# Altium schematic sheet power.SchDoc
size A4; SheetNumber: 3; SheetTotal: 7
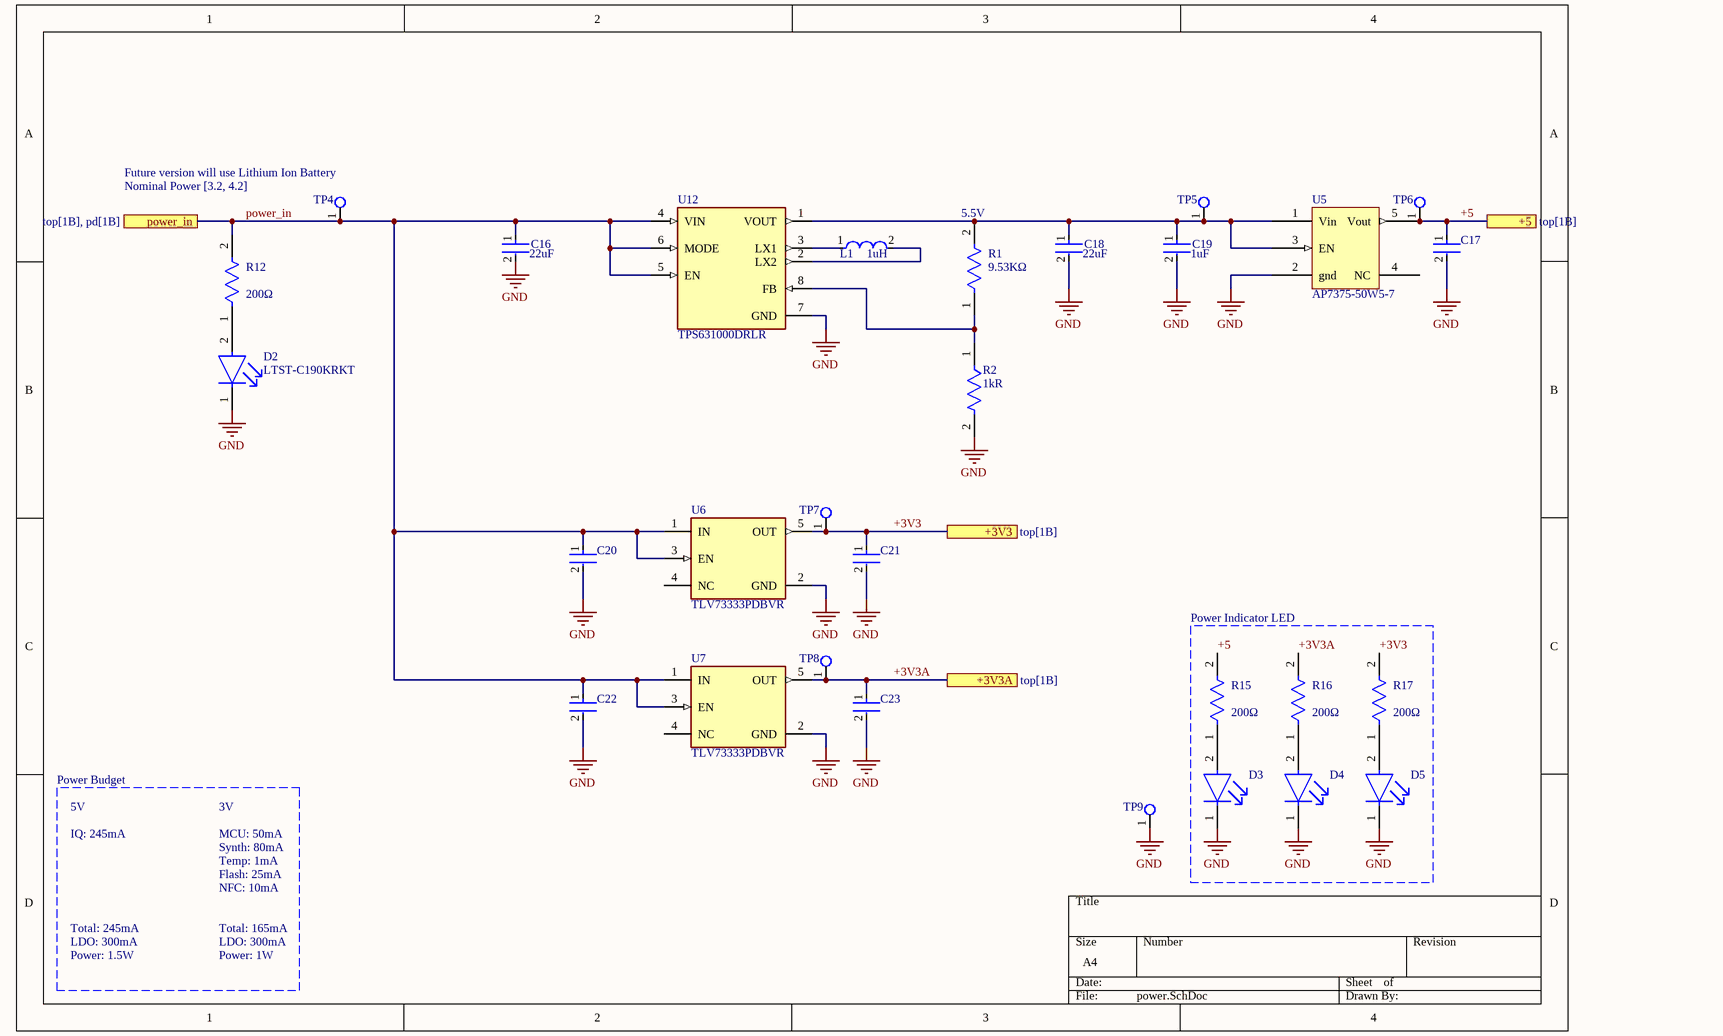
[diagram p0: power.SchDoc]

## Parts
C16  Capacitance: 22uF  [FP-GRM188-0_2-IPC_C]  (hidden comment: GRM188R61A226ME15D)
C17  GRM155R61A106ME11D  [FP-GRM155-0_2-IPC_A]  (value not drawn)
C18  Capacitance: 22uF  [FP-GRM188-0_2-IPC_C]  (hidden comment: GRM188R61A226ME15D)
C19  Capacitance: 1uF  [FP-CL10-IPC_C]  (hidden comment: CL10B105KP8NNNC)
C20  GRM155R61A106ME11D  [FP-GRM155-0_2-IPC_A]  (value not drawn)
C21  GRM155R61A106ME11D  [FP-GRM155-0_2-IPC_A]  (value not drawn)
C22  GRM155R61A106ME11D  [FP-GRM155-0_2-IPC_A]  (value not drawn)
C23  GRM155R61A106ME11D  [FP-GRM155-0_2-IPC_A]  (value not drawn)
D2  LTST-C190KRKT  [FP-LTST-C190KRKT-MFG]
D3  LTST-C190KRKT  [FP-LTST-C190KRKT-MFG]  (value not drawn)
D4  LTST-C190KRKT  [FP-LTST-C190KRKT-MFG]  (value not drawn)
D5  LTST-C190KRKT  [FP-LTST-C190KRKT-MFG]  (value not drawn)
L1  Inductance: 1uH  [FP-LQM21PH_G0-IPC_C]  (hidden comment: LQM21PN1R0NGRD)
R1  value 9.53KΩ  [FP-RT0603-MFG]  (hidden comment: RT0603BRD079K53L)
R2  Resistance: 1kR  [FP-RC0603-0_55-IPC_C]  (hidden comment: RC0603FR-071KL)
R12  value 200Ω  [FP-RT0402-MFG]  (hidden comment: RT0402BRD07200RL)
R15  value 200Ω  [FP-RT0402-MFG]  (hidden comment: RT0402BRD07200RL)
R16  value 200Ω  [FP-RT0402-MFG]  (hidden comment: RT0402BRD07200RL)
R17  value 200Ω  [FP-RT0402-MFG]  (hidden comment: RT0402BRD07200RL)
TP4  Test Point  [test_point]  (value not drawn)
TP5  Test Point  [test_point]  (value not drawn)
TP6  Test Point  [test_point]  (value not drawn)
TP7  Test Point  [test_point]  (value not drawn)
TP8  Test Point  [test_point]  (value not drawn)
TP9  Test Point  [test_point]  (value not drawn)
U5  AP7375-50W5-7  [DIODES SOT25]
U6  TLV73333PDBVR  [FP-DBV0005A-MFG]
U7  TLV73333PDBVR  [FP-DBV0005A-MFG]
U12  TPS631000DRLR  [SOT50P160X60-8N]

## Blocks framed on the sheet
Power Indicator LED: D3-D5 R15-R17

## Ports
+3V3 (see top[1B]), +3V3A (see top[1B]), +5 (see top[1B]), power_in (see top[1B], pd[1B])

## Nets
GND: C16.2 C17.2 C18.2 C19.2 C20.2 C21.2 C22.2 C23.2 D2.1(C) D3.1(C) D4.1(C) D5.1(C) R2.2 TP9.1 U5.2(gnd) U6.2(GND) U7.2(GND) U12.7(GND)
+3V3: C21.1 R17.2 TP7.1 U6.5(OUT) ; port +3V3
+3V3A: C23.1 R16.2 TP8.1 U7.5(OUT) ; port +3V3A
+5: C17.1 R15.2 TP6.1 U5.5(Vout) ; port +5
power_in: C16.1 C20.1 C22.1 R12.2 TP4.1 U6.1(IN) U6.3(EN) U7.1(IN) U7.3(EN) U12.4(VIN) U12.5(EN) U12.6(MODE) ; port power_in
NetC18_1: C18.1 C19.1 R1.2 TP5.1 U5.1(Vin) U5.3(EN) U12.1(VOUT)
NetD2_2: D2.2(A) R12.1
NetD3_2: D3.2(A) R15.1
NetD4_2: D4.2(A) R16.1
NetD5_2: D5.2(A) R17.1
NetL1_1: L1.1 U12.3(LX1)
NetL1_2: L1.2 U12.2(LX2)
NetR1_1: R1.1 R2.1 U12.8(FB)

Not connected (* = marked no-connect by the designer): U5 4(NC); U6 4(NC); U7 4(NC)

## Notes on the sheet
- (near TP4) Future version will use Lithium Ion Battery
- Nominal Power [3.2, 4.2]
- (near R1) 5.5V
- Power Budget
- 5V
- IQ: 245mA
- 3V
- MCU: 50mA
- Synth: 80mA
- Temp: 1mA
- Flash: 25mA
- NFC: 10mA
- Total: 245mA
- LDO: 300mA
- Power: 1.5W
- Total: 165mA
- Power: 1W

## Library data of the parts
C16 C18 = CMP-2000-06337-3: Chip Multilayer Ceramic Capacitors for General Purpose, 0603, 22uF, X5R, 15%, 20%, 10V; Tolerance: 20%; Weight: 0.000222oz; Material: Ceramic; Depth: 0.8mm; Length: 1.6mm; Termination: SMD/SMT; Packaging: Tape and Reel; Width: 0.8mm; Voltage Rating: 10V; Case Code (Imperial): 0603; Mount: Surface Mount; Voltage Rating (DC): 10V; Case/Package: 0603; Thickness: 0.039inch; REACH SVHC: No SVHC; Dielectric: X5R; Height: 0.8mm; Package Quantity: 4000; Case Code (Metric): 1608; Min Operating Temperature: -55°C; Lead Free: Lead Free; Max Operating Temperature: 85°C
C17 C20-C23 = CMP-06035-026070-1: Chip Multilayer Ceramic Capacitors for General Purpose, 0402, 10uF, X5R, 15%, 20%, 10V
C19 = CMP-2000-06094-2: Cap Ceramic 1uF 10V X7R ±10% Pad SMD 0603 +125°C T/R; Packaging: Tape and Reel; Depth: 0.8mm; Voltage Rating: 10V; Lead Free: Lead Free; Radiation Hardening: No; Length: 1.6mm; Package Quantity: 1; Mount: Surface Mount; Case/Package: 0603; Max Operating Temperature: 125°C; Case Code (Metric): 1608; Height: 0.8mm; Min Operating Temperature: -55°C; Dielectric: X7R; Contact Plating: Tin; Case Code (Imperial): 0603; Thickness: 0.035inch; Voltage Rating (DC): 10V; Tolerance: 10%; Width: 0.031inch
D2-D5 = CMP-1674-00011-2: LED RED CLEAR CHIP SMD; Reverse Voltage: 5V; Viewing Angle: 130°; Power Rating: 75mW; Test Current: 20mA; Number of Elements: 1; Lens Color: Colorless; Wavelength: 639nm; Dominant Wavelength: 631nm; Lens Style: Diffused; Forward Current: 30mA; Forward Voltage: 2.4V; Luminous Intensity: 54mcd; Color: Red; Case Code (Imperial): 0603; Lens Transparency: Clear; Lead Free: Lead Free; Package Quantity: 1; Packaging: Tape and Reel; Max Operating Temperature: 85°C; Number of Pins: 2; Height: 0.8mm; Case/Package: 0603; Number of LEDs: 1; Width: 0.8mm; Case Code (Metric): 1608; Depth: 0.8mm; Mount: Surface Mount; Radiation Hardening: No; Length: 1.6mm; Illumination Color: Red; Power Dissipation: 75mW; Min Operating Temperature: -55°C
L1 = CMP-06042-017027-1: Multilayer Type Inductor for Power Lines, 0805 (2012), 1μH, 30%, 0.0825Ω, 1.3A; Test Frequency: 1MHz; Shielding: Shielded; Self Resonant Frequency: 50MHz; DC Resistance (DCR): 82.5mR; Core Material: Ferrite; Inductance Tolerance: 30%; Military Standard: Not; Height - Seated (Max): 0.039inch; Max DC Current: 1.3A; Depth: 1.4mm; Packaging: Tape and Reel; Mount: Surface Mount; Width: 0.049inch; Case Code (Imperial): 0805; RoHS Compliant: Yes; Height: 0.9mm; Case/Package: 0805; Max Operating Temperature: 125°C; Min Operating Temperature: -55°C; REACH SVHC: No SVHC; DC Current: 1.3A; Current Rating: 1.3A; Weight: 0.000194oz; Case Code (Metric): 2012; Termination: SMD/SMT; Length: 2mm; Series: LQM21PN_GR; Tolerance: 30%; Package Quantity: 4000
R1 = CMP-03412-004903-1: RES SMD 9.53K OHM 0.1% 1/10W; Manufacturer: Yageo; Tolerance: 0.001; Power Rating: 0.1W; Temperature Coefficient: 25 ppm/°C; Voltage Rating: 75V; Description: RT0603 9.53KΩ 0.1W 25 ppm/°C 0.10%; Device Class L3: Chip SMD Resistors; Octopart: https://octopart.com/rt0603brd079k53l-yageo-1387406; Mouser Description: Thin Film Resistors - SMD 1/10W 9.53K ohm .1% 25ppm; Temperature Range High: +155°C; Digikey Description: RES SMD 9.53K OHM 0.1% 1/10W; Lead Free: Yes; Package: RT0603; Series: RT; ComponentLink2URL: http://www.yageo.com/documents/recent/PYu-RT_1-to-0.01_RoHS_L_9.pdf; Composition: Thin Film; Automotive: No; RoHS: TRUE; Resistance: 9.53KΩ; Footprint Url: http://www.yageo.com/exep/pages/download/literatures/PYu-R_Mount_10.pdf; Temperature: -55°C to +155°C; Temperature Range Low: -55°C; Height: 0.55mm; Device Class L2: Resistors; Device Class L1: Passive Components; Category: Res; ComponentLink2Description: Datasheet; Ipc Land Pattern Name: RESC16080X45; Manufacturer Part Number: RT0603BRD079K53L
R2 = CMP-1659-00009-5: RES 1K OHM 1% 1/10W 0603; Voltage Rating: 50V; Power Rating: 100mW; Temperature Coefficient: 100ppm/°C; Military Standard: Not; REACH SVHC: No SVHC; Size Code: 0603; Features: Moisture Resistant; Number of Terminations: 2; Technology: THICK FILM; Series: RC; Case Code (Metric): 1608; Resistance Tolerance: 1%; Resistor Type: Thick Film; Termination: SMD/SMT; Contact Plating: Tin; Radiation Hardening: No; Min Operating Temperature: -55°C; Max Operating Temperature: 155°C; Packaging: Tape and Reel; Max Power Dissipation: 100mW; RoHS Compliant: Yes; Height: 0.45mm; Lead Free: Lead Free; Case/Package: 0603; Length: 1.6mm; Tolerance: 1%; Case Code (Imperial): 0603; Construction: Rectangular; Depth: 0.8mm
R12 R15-R17 = CMP-03412-023045-1: RES SMD 200 OHM 0.1% 1/16W 0402; Manufacturer: Yageo; Tolerance: 0.001; Voltage Rating: 50V; Temperature Coefficient: 25 ppm/°C; Power Rating: 0.063W; Device Class L2: Resistors; RoHS: TRUE; Series: RT; Resistance: 200Ω; Mouser Description: Thin Film Resistors - SMD 1/16W 200 ohm .1% 25ppm; Manufacturer Part Number: RT0402BRD07200RL; Footprint Url: http://www.yageo.com/exep/pages/download/literatures/PYu-R_Mount_10.pdf; ComponentLink2URL: http://www.yageo.com/documents/recent/PYu-RT_1-to-0.01_RoHS_L_9.pdf; Device Class L1: Passive Components; Height: 0.35mm; Temperature: -55°C to +155°C; Temperature Range High: +155°C; Package: RT0402; Device Class L3: Chip SMD Resistors; Lead Free: Yes; Ipc Land Pattern Name: RESC10050X30; Category: Res; Digikey Description: RES SMD 200 OHM 0.1% 1/16W 0402; Automotive: No; ComponentLink2Description: Datasheet; Composition: Thin Film; Temperature Range Low: -55°C; Octopart: https://octopart.com/rt0402brd07200rl-yageo-1238579
U6 U7 = CMP-04917-000053-1: IC REG LINEAR 3.3V 300MA SOT23-5; Manufacturer: Texas Instruments; Max Junction Temp: +125°C; Accuracy Percentage: 1%; Min Supply Voltage: 1.4V; Number Of Outputs: 1; Dropout Voltage: 125mV; Nominal Supply Current: 34uA; Max Supply Voltage: 5.5V; Output Type: Fixed; Standoff Height: 0mm; Digikey Description: IC REG LINEAR 3.3V 300MA SOT23-5; Manufacturer Part Number: TLV73333PDBVR; Temperature Range High: +125°C; Temperature: -40°C to +125°C; Output Current: 300mA; Mouser Description: LDO Voltage Regulators Capacitr-Free 300-mA 5-SOT-23 -40 to 125; Automotive: No; Height: 1.45mm; Device Class L3: Voltage Regulators - Linear; ComponentLink2Description: Datasheet; Device Class L1: Integrated Circuits (ICs); ComponentLink2URL: http://www.ti.com/lit/ds/symlink/tlv733p.pdf; Octopart: https://octopart.com/tlv73333pdbvr-texas+instruments-51080890; Temperature Range Low: -40°C; RoHS: TRUE; Lead Free: Yes; Output Voltage: 3.3V; Package: DBV0005A; Device Class L2: Power Management ICs; Category: IC